# EAGLE design ContactSensor (EAGLE 9.6.2)
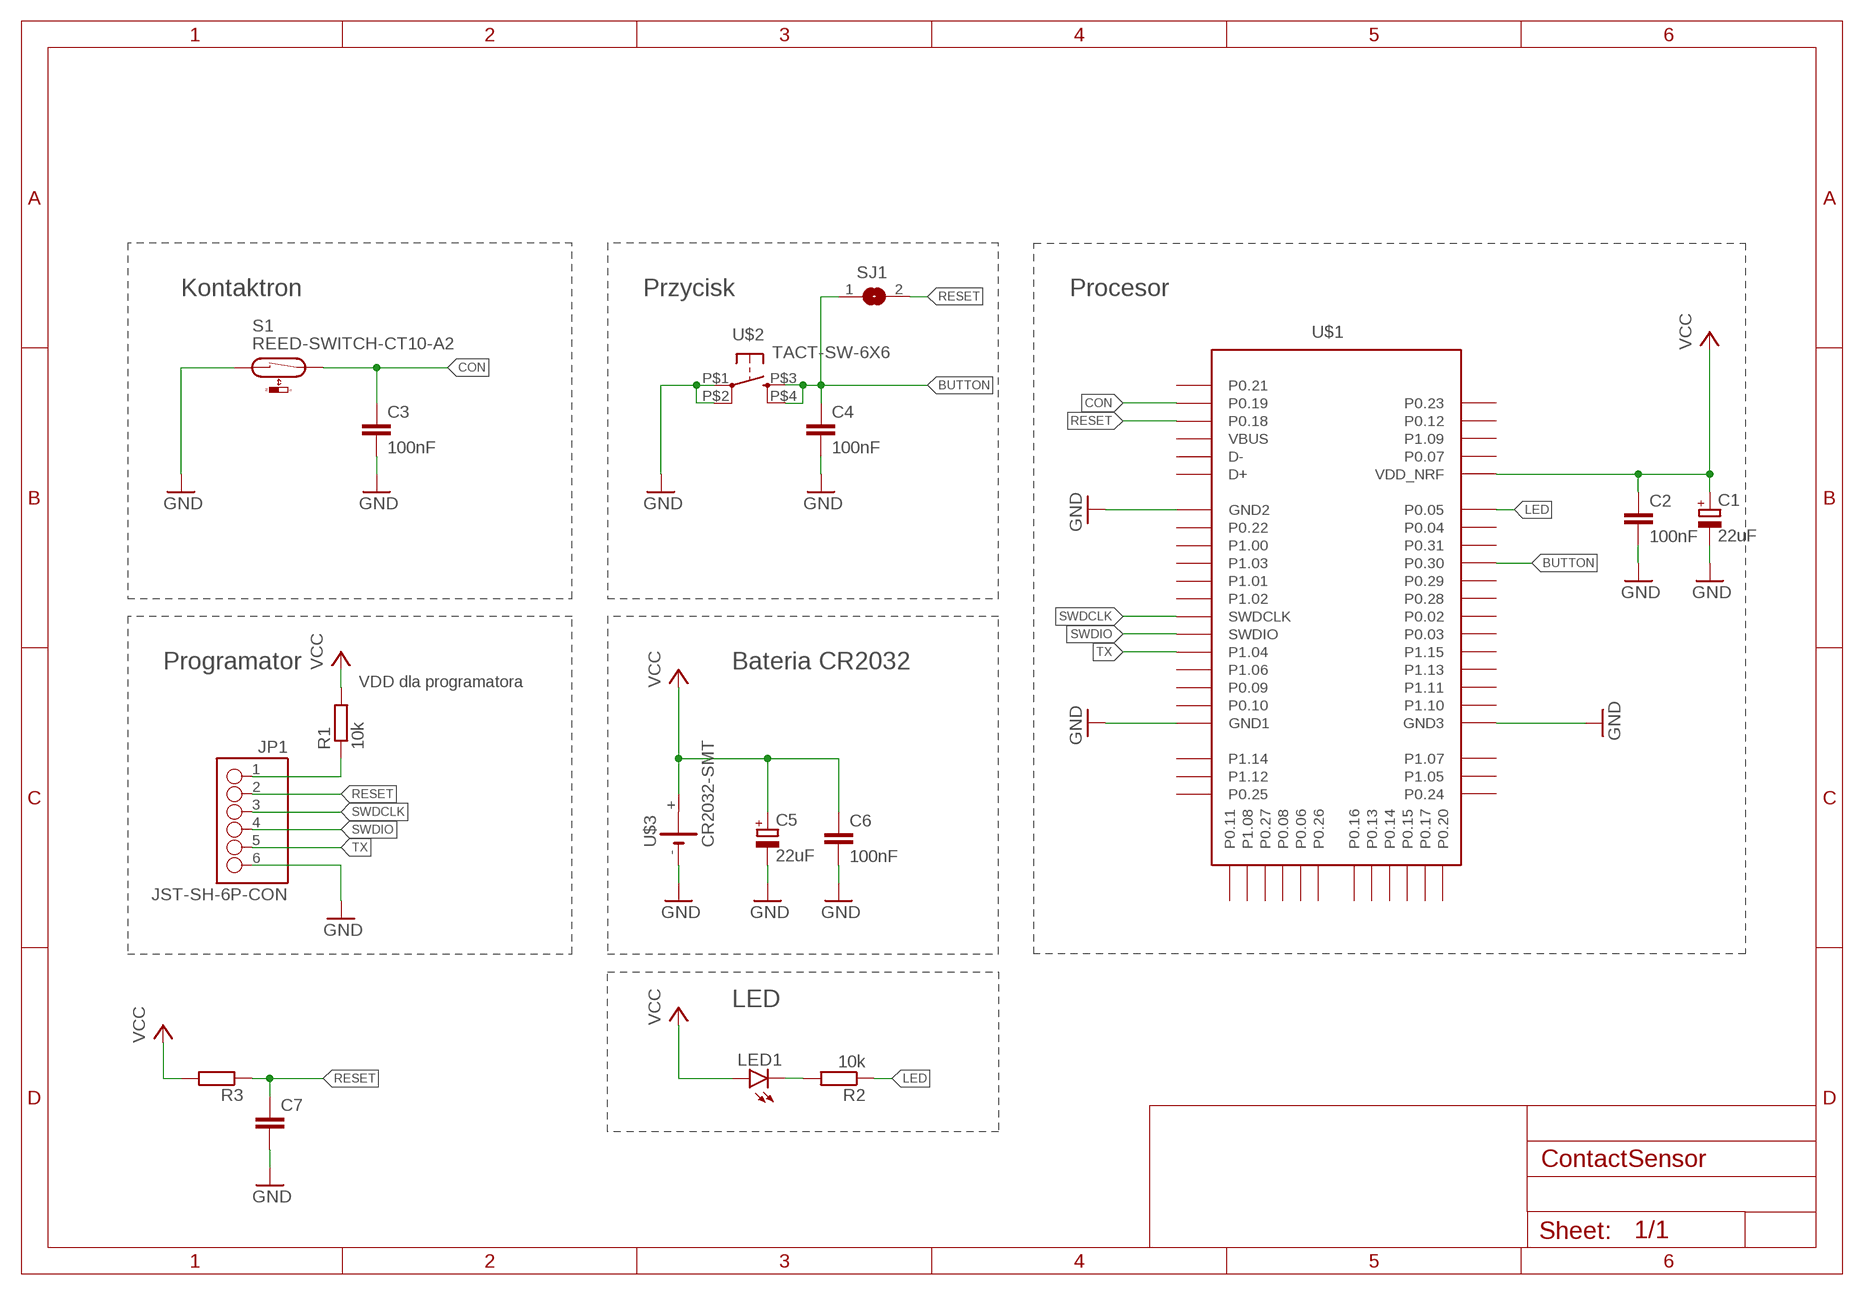
[diagram p0: schematic, sheet 1]

## Parts
C1  22uF  CPOL-EUCT3528  [CT3528]
C2  100nF  C-EUC0805K  [C0805K]
C3  100nF  C-EUC0805K  [C0805K]
C4  100nF  C-EUC0805K  [C0805K]
C5  22uF  CPOL-EUCT3528  [CT3528]
C6  100nF  C-EUC0805K  [C0805K]
C7  C-EUC0603K  [C0603K]
JP1  JST-SH-6P-CON  [JST-SH-6P-FOOT]
LED1  LEDCHIPLED_0603  [CHIPLED_0603]
R1  10k  R-EU_R0603  [R0603]
R2  10k  R-EU_R0603  [R0603]
R3  R-EU_R0402  [R0402]
S1  REED-SWITCH-CT10-A2  [CT10-A2]
SJ1  SJ  [SJ]
U$1  HOLYIOT_18010  [PCBCOMPONENT_1]
U$2  TACT-SW-6X6  [6X6-TACT-SWITCH-SMD]
U$3  CR2032-SMT  [CR2032-SMT]

## Nets
BUTTON: C4.1 SJ1.1 U$1.P0.30 U$2.P$3(S) U$2.P$4(S1)
CON: C3.1 S1.2 U$1.P0.19
GND: C1.- C2.2 C3.2 C4.2 C5.- C6.2 C7.2 JP1.6 S1.1 U$1.GND1(GND2) U$1.GND2(GND3) U$1.GND(GND1) U$2.P$1(P) U$2.P$2(P1) U$3.-
LED: R2.1 U$1.P0.05
N$1: JP1.1 R1.1
N$4: LED1.C R2.2
RESET: C7.1 JP1.2 R3.1 SJ1.2 U$1.P0.18
SWDCLK: JP1.3 U$1.SWDCLK
SWDIO: JP1.4 U$1.SWDIO
TX: JP1.5 U$1.P1.04
VCC: C1.+ C2.1 C5.+ C6.1 LED1.A R1.2 R3.2 U$1.VDD_NRF U$3.+
Unconnected: U$1.D+ U$1.D- U$1.P0.02 U$1.P0.03 U$1.P0.04 U$1.P0.06 U$1.P0.07 U$1.P0.08 U$1.P0.09 U$1.P0.10 U$1.P0.11 U$1.P0.12 U$1.P0.13 U$1.P0.14 U$1.P0.15 U$1.P0.16 U$1.P0.17 U$1.P0.20 U$1.P0.21 U$1.P0.22 U$1.P0.23 U$1.P0.24 U$1.P0.25 U$1.P0.26 U$1.P0.27 U$1.P0.28 U$1.P0.29 U$1.P0.31 U$1.P1.00 U$1.P1.01 U$1.P1.02 U$1.P1.03 U$1.P1.05 U$1.P1.06 U$1.P1.07 U$1.P1.08 U$1.P1.09 U$1.P1.10 U$1.P1.11 U$1.P1.12 U$1.P1.13 U$1.P1.14 U$1.P1.15 U$1.VBUS

## Notes on the sheet
- Kontaktron | Przycisk | Procesor
- Programator | Bateria CR2032
- VDD dla programatora
- LED

## Library data of the parts
C1 C5 = rcl:CPOL-EU: POLARIZED CAPACITOR, European symbol; SPICEPREFIX: C
C2-C4 C6 C7 = rcl:C-EU: CAPACITOR, European symbol; SPICEPREFIX: C
JP1 = Inrzynierka:JST-SH-6P-CON
LED1 = Inrzynierka:LED: LED OSRAM: - CHIPLED LG R971, LG N971, LY N971, LG Q971, LY Q971, LO R971, LY R971 LH N974, LH R974 LS Q976, LO Q976, LY Q976 LO Q996 - Hyper CHIPLED LW Q18S LB Q993, LB Q99A, LB R99A - SideLED LS A670, LO A670, LY A670, LG A670, LP A670 LB A673, LV A673, LT A673, LW A673 LH A674 LY A675 LS A676, LA A676, LO A676, LY A676, LW A676 LS A679, LY A679, LG A679 - Hyper Micro SIDELED® LS Y876, LA Y876, LO Y876, LY Y876 LT Y87S - SmartLED LW L88C, LW L88S LB L89C, LB L89S, LG L890 LS L89K, LO L89K, LY L89K LS L896, LA L896, LO L896, LY L896 - TOPLED LS T670, LO T670, LY T670, LG T670, LP T670 LSG T670, LSP T670, LSY T670, LOP T670, LYG T670 LG T671, LOG T671, LSG T671 LB T673, LV T673, LT T673, LW T673 LH T674 LS T676, LA T676, LO T676, LY T676, LB T676, LH T676, LSB T676, LW T676 LB T67C, LV T67C, LT T67C, LS T67K, LO T67K, LY T67K, LW E67C LS E67B, LA E67B, LO E67B, LY E67B, LB E67C, LV E67C, LT E67C LW T67C LS T679, LY T679, LG T679 LS T770, LO T770, LY T770, LG T770, LP T770 LB T773, LV T773, LT T773, LW T773 LH T774 LS E675, LA E675, LY E675, LS T675 LS T776, LA T776, LO T776, LY T776, LB T776 LHGB T686 LT T68C, LB T68C - Hyper Mini TOPLED® LB M676 - Mini TOPLED Santana® LG M470 LS M47K, LO M47K, LY M47K Source: http://www.osram.convergy.de LUXEON: - LUMILED® LXK2-PW12-R00, LXK2-PW12-S00, LXK2-PW14-U00, LXK2-PW14-V00 LXK2-PM12-R00, LXK2-PM12-S00, LXK2-PM14-U00 LXK2-PE12-Q00, LXK2-PE12-R00, LXK2-PE12-S00, LXK2-PE14-T00, LXK2-PE14-U00 LXK2-PB12-K00, LXK2-PB12-L00, LXK2-PB12-M00, LXK2-PB14-N00, LXK2-PB14-P00, LXK2-PB14-Q00 LXK2-PR12-L00, LXK2-PR12-M00, LXK2-PR14-Q00, LXK2-PR14-R00 LXK2-PD12-Q00, LXK2-PD12-R00, LXK2-PD12-S00 LXK2-PH12-R00, LXK2-PH12-S00 LXK2-PL12-P00, LXK2-PL12-Q00, LXK2-PL12-R00 Source: www.luxeon.com KINGBRIGHT: KA-3528ASYC Source: www.kingbright.com
R1-R3 = rcl:R-EU_: RESISTOR, European symbol; SPICEPREFIX: R
S1 = Inrzynierka:REED-SWITCH-: Reed Sensor; OC_FARNELL: unknown
SJ1 = jumper:SJ: SMD solder JUMPER
U$1 = Inrzynierka:HOLYIOT_18010
U$2 = Inrzynierka:TACT-SW-6X6
U$3 = Inrzynierka:CR2032-SMT

## Board
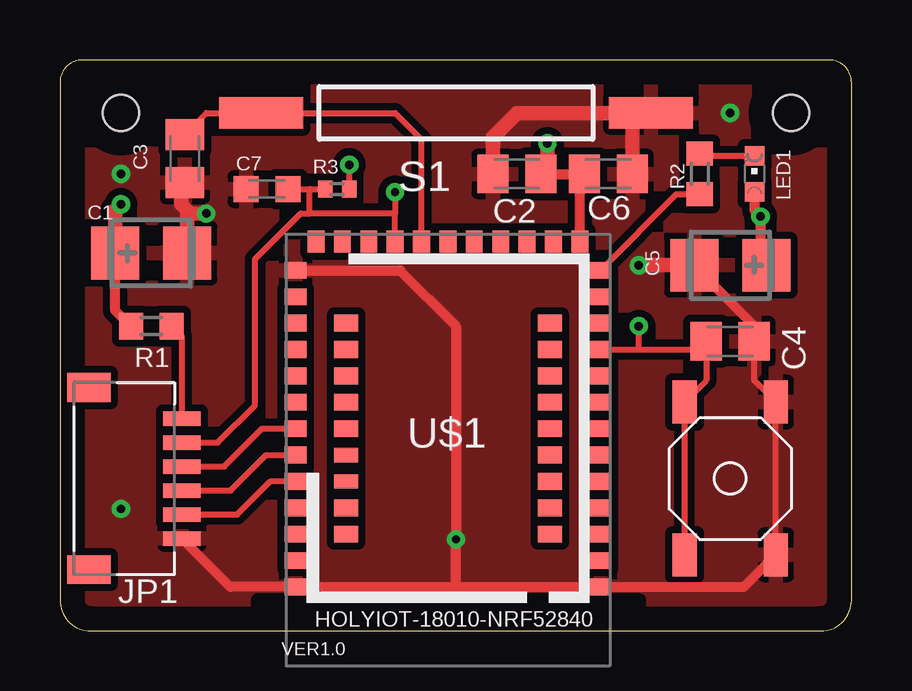
[diagram p1: board, top side]
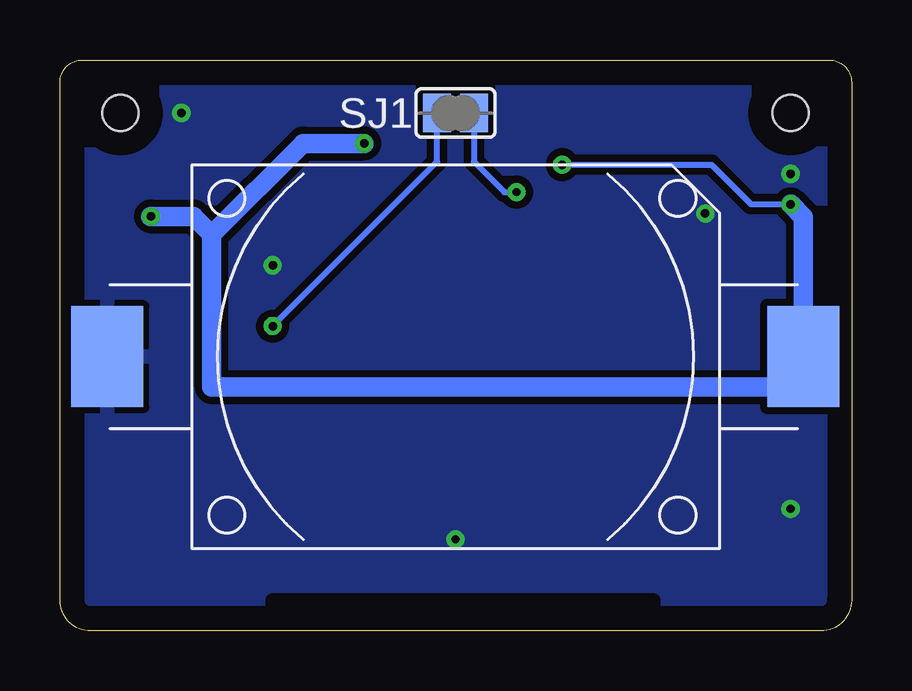
[diagram p2: board, bottom side, seen from below]

Size 33 x 23.8 mm. Coordinates in mm from the lower left corner, seen from the top.
Outline: 0,22.86 0,1.27 arc90 1.27,0 31.73,0 arc90 33,1.27 33,22.86 arc90 32.06,23.8 0.94,23.8 arc90 0,22.86
Copper layers (1*16): Top 0.035mm / dielectric 1.2mm / Bottom 0.035mm
Design rules "default": minimum track width 6mil, minimum drill 0.35mm, track to track 6mil, track to pad 6mil, pad to pad 6mil, via to via 6mil, smd to smd 6mil, copper to edge 40mil, drill to drill 6mil, minimum pad ring 10mil, minimum via ring 8mil, stop-mask expansion 4mil, vias tented up to drill 0mil, thermal gap 10mil
Holes 1.5 mm at 2.54,21.59 30.48,21.59

### Footprints (pad centres in the part's own frame; a part is rotated, then mirrored left to right if it is on the bottom)
CT3528 = smd 2 x 2.2: + -1.5,0; - 1.5,0
C0805K = smd 1.3 x 1.6: 1 -1,0; 2 1,0
C0603K = smd 1.05 x 1.08: 1 -0.875,0; 2 0.875,0
JST-SH-6P-FOOT = smd 0.6 x 1.55: 1 -2.5,0; 2 -1.5,0; 3 -0.5,0; 4 0.5,0; 5 1.5,0; 6 2.5,0 | smd 1.2 x 1.8: P-MOUNT1 -3.8,-3.875; P-MOUNT2 3.8,-3.875
CHIPLED_0603 = smd 0.8 x 0.8: A 0,-0.75; C 0,0.75
R0603 = smd 1 x 1.1: 1 -0.85,0; 2 0.85,0
R0402 = smd 0.6 x 0.7: 1 -0.5,0; 2 0.5,0
CT10-A2 = smd 3.5 x 1.3: 1 -8.135,0; 2 8.135,0
SJ = smd 1.168 x 1.6: 1 -0.762,0; 2 0.762,0
PCBCOMPONENT_1 = smd 0.7 x 0.9: D+ 5.837,-7.336; D- 4.737,-7.336; P0.07 -4.063,-7.336; P0.12 -1.863,-7.336; P0.18 2.537,-7.336; P0.19 1.437,-7.336; P0.21 0.337,-7.336; P0.23 -0.763,-7.336; P1.09 -2.963,-7.336; VBUS 3.637,-7.336; VDD_NRF -5.163,-7.336 | smd 0.9 x 0.7: GND -6.013,7.064; GND1 6.687,-6.136; GND2 6.687,7.064; P0.02 -6.013,0.464; P0.03 -6.013,1.564; P0.04 -6.013,-5.036; P0.05 -6.013,-6.136; P0.09 6.687,4.864; P0.10 6.687,5.964; P0.22 6.687,-5.036; P0.28 -6.013,-0.636; P0.29 -6.013,-1.736; P0.30 -6.013,-2.836; P0.31 -6.013,-3.936; P1.00 6.687,-3.936; P1.01 6.687,-1.736; P1.02 6.687,-0.636; P1.03 6.687,-2.836; P1.04 6.687,2.664; P1.06 6.687,3.764; P1.10 -6.013,4.864; P1.11 -6.013,5.964; P1.13 -6.013,3.764; P1.15 -6.013,2.664; SWDCLK 6.687,0.464; SWDIO 6.687,1.564 | smd 1 x 0.7: P0.06 -3.913,-2.836; P0.08 -3.913,-1.736; P0.11 -3.913,1.564; P0.13 4.587,-2.836; P0.14 4.587,-1.736; P0.15 4.587,-0.636; P0.16 4.587,-3.936; P0.17 4.587,0.464; P0.25 -3.913,2.664; P0.26 -3.913,-3.936; P0.27 -3.913,-0.636; P1.05 4.587,3.764; P1.07 4.587,4.864; P1.08 -3.913,0.464; P1.12 -3.913,3.764; P1.14 -3.913,4.864 | smd 1 x 0.6: P0.20 4.587,1.564; P0.24 4.587,2.664
6X6-TACT-SWITCH-SMD = smd 1.778 x 1.016: P$1 -3.188,-1.905; P$2 3.188,-1.905; P$3 -3.188,1.905; P$4 3.188,1.905
CR2032-SMT = smd 3 x 4.2: + 14.5,0; - -14.516,0

### Placement (x,y rotation side)
C1  3.81,15.75 0 top
C2  19.05,19.05 180 top
C3  5.21,19.68 270 top
C4  27.94,12.06 0 top
C5  27.94,15.24 180 top
C6  22.86,19.05 0 top
C7  8.64,18.41 180 top
JP1  5.08,6.35 270 top
LED1  28.96,19.05 0 top
R1  3.81,12.7 180 top
R2  26.67,19.05 90 top
R3  11.56,18.41 0 top
S1  16.51,21.59 180 top
SJ1  16.51,21.59 0 bottom
U$1  16.51,8.89 180 top
U$2  27.94,6.35 90 top
U$3  16.51,11.43 0 bottom

### Tracks (layer width: path | path; a pad name or v marks a point on that pad's centre or on a via)
BUTTON  (via drill 0.35)
  Top 0.254: U$2.P$3 U$2.P$4 26.94,10.44 26.94,11.43 | C4.1 26.94,11.43 | U$1.P0.30 24.13,11.73 | 24.13,11.73 26.64,11.73 26.94,11.43 | 24.13,11.73 v24.13,12.7
  Bottom 0.254: SJ1.1 17.27,19.56 v24.13,12.7
CON
  Top 0.254: C3.1 6.11,21.59 S1.2 13.97,21.59 15.07,20.49 U$1.P0.19
GND  (via drill 0.35)
  Top 0.254: U$2.P$1 U$2.P$2 28.94,10.44 C4.2
  Top 0.406: JP1.6 7.1,1.83 U$1.GND2 16.51,1.83 | 16.51,1.83 U$1.GND 28.51,1.83 U$2.P$1 | C4.2 28.94,12.7 26.44,15.2 C5.- | 16.51,1.83 v16.51,3.81 16.51,12.7 14.18,15.03 U$1.GND1
  Top 0.61: 5.31,17.53 C1.- | C3.2 5.06,18.53 5.06,17.78 5.31,17.53 | C2.2 18.05,20.59 19.05,21.59 S1.1 23.86,21.44 C6.2 | C5.- v24.13,15.24 | 5.31,17.53 5.44,17.4 v6.1,17.4
  other vias: 2.54,5.08 2.54,19.05 27.94,21.59
  pour Top (isolate 0.305): -1.27,25.4 35.56,25.4 35.56,-1.27 -2.54,-1.27 -2.54,25.4
  pour Bottom (isolate 0.305): -3.81,26.67 36.83,26.67 36.83,-2.54 -5.08,-2.54 -5.08,26.67
LED
  Top 0.254: U$1.P0.05 25.7,18.2 R2.1
N$1
  Top 0.254: R1.1 5.08,12.28 JP1.1
N$4
  Top 0.254: LED1.C 26.77,19.8 R2.2
RESET  (via drill 0.35)
  Top 0.254: JP1.2 6.58,7.85 8.13,9.4 8.13,15.49 10.03,17.4 10.41,17.4 | 13.97,17.4 U$1.P0.18 | 13.97,17.4 10.41,17.4 | v13.97,18.29 13.97,17.4 | C7.1 10.41,18.41 | 10.41,18.41 R3.1 | 10.41,17.4 10.41,18.41
  Bottom 0.254: SJ1.2 15.75,19.56 14.48,18.29 v13.97,18.29
SWDCLK
  Top 0.254: JP1.3 6.85,6.85 8.43,8.43 U$1.SWDCLK
SWDIO
  Top 0.254: JP1.4 7.12,5.85 8.6,7.33 U$1.SWDIO
TX
  Top 0.254: JP1.5 7.39,4.85 8.76,6.22 U$1.P1.04
VCC  (via drill 0.35)
  Top 0.254: R3.2 12.06,18.42 v12.06,19.43
  Top 0.406: U$1.VDD_NRF 21.67,18.86 21.73,18.91 | 21.73,18.91 C6.1 | C2.1 21.59,19.05 21.73,18.91 | C5.+ 29.21,15.24 v29.21,17.27 28.96,17.53 LED1.A | R1.2 2.31,13.35 C1.+
  Top 0.61: C1.+ 2.31,17.55 v2.54,17.78 | C2.1 20.32,19.32 v20.32,20.32
  Bottom 0.254: v2.54,17.78 4.19,17.78 5.84,19.43 v12.06,19.43
  Bottom 0.61: U$3.+ 2.54,11.96
  Bottom 0.813: 26.67,16.51 26.67,10.16 3.28,10.16 U$3.+ 2.01,17.25 v2.54,17.78 | 26.67,16.51 22.86,20.32 v20.32,20.32 | v29.21,17.27 27.43,17.27 26.67,16.51